# Altium project TwoPinSherlockDistribution.PrjPcb
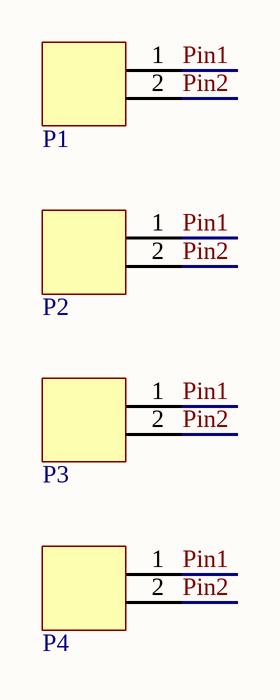
[diagram p0: TwoPinSherlockDistribution.SchDoc]
1 sheet, 4 parts. Net scope: global (net labels, ports and power ports of the same name join across sheets).
Board file: TwoPinSherlockDistribution.PcbDoc

## Sheet TwoPinSherlockDistribution.SchDoc
size A

### Parts
P1  2-pin Horz Sherlock  [MOLEX-HDR-1X2-SHERLOCK-HORZ]  (value not drawn)
P2  2-pin Horz Sherlock  [MOLEX-HDR-1X2-SHERLOCK-HORZ]  (value not drawn)
P3  2-pin Horz Sherlock  [MOLEX-HDR-1X2-SHERLOCK-HORZ]  (value not drawn)
P4  2-pin Horz Sherlock  [MOLEX-HDR-1X2-SHERLOCK-HORZ]  (value not drawn)

### Nets
Pin1: P1.1 P2.1 P3.1 P4.1
Pin2: P1.2 P2.2 P3.2 P4.2

### Library data of the parts
P1-P4 = MOLEX-HDR-1x2-SHERLOCK_RA: Header, Molex, 2mm Pitch Sherlock Header, Single Row, Horizontal, 2 Circuits, Length 3.3mm,  0353630260; Manufacturer: Molex Inc; Manufacturer Part Number: 0353630260; Supplier Part Number 1: WM18931-ND; Supplier 1: Digi-Key